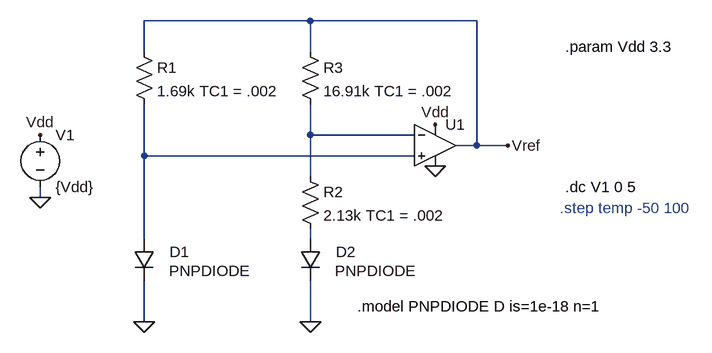
[diagram p0: schematic Bandgap_V1-sensitivity.asc]
Bandgap_V1-sensitivity.asc, the LTspice schematic file:
Version 4
SHEET 1 1104 680
WIRE 336 -288 80 -288
WIRE 592 -288 336 -288
WIRE 80 -240 80 -288
WIRE 336 -240 336 -288
WIRE 336 -112 336 -160
WIRE 496 -112 336 -112
WIRE 592 -96 592 -288
WIRE 592 -96 560 -96
WIRE 640 -96 592 -96
WIRE 80 -80 80 -160
WIRE 496 -80 80 -80
WIRE 336 -48 336 -112
WIRE -80 -16 -80 -32
WIRE 80 48 80 -80
WIRE 336 48 336 32
WIRE 80 176 80 112
WIRE 336 176 336 112
FLAG 336 176 0
FLAG 80 176 0
FLAG 528 -64 0
FLAG -80 -16 0
FLAG -80 -112 Vdd
FLAG 528 -128 Vdd
FLAG 640 -96 Vref
SYMBOL diode 64 48 R0
WINDOW 0 55 20 Left 2
WINDOW 3 54 49 Left 2
SYMATTR InstName D1
SYMATTR Value PNPDIODE
SYMBOL diode 320 48 R0
WINDOW 0 55 20 Left 2
WINDOW 3 54 49 Left 2
SYMATTR InstName D2
SYMATTR Value PNPDIODE
SYMBOL res 64 -256 R0
SYMATTR InstName R1
SYMATTR Value 1.69k TC1 = .002
SYMBOL res 320 -64 R0
SYMATTR InstName R2
SYMATTR Value 2.13k TC1 = .002
SYMBOL res 320 -256 R0
SYMATTR InstName R3
SYMATTR Value 16.91k TC1 = .002
SYMBOL voltage -80 -128 R0
WINDOW 123 0 0 Left 2
WINDOW 39 0 0 Left 2
SYMATTR InstName V1
SYMATTR Value {Vdd}
SYMBOL Opamps\\UniversalOpamp2 528 -96 R0
SYMATTR InstName U1
TEXT 408 152 Left 2 !.model PNPDIODE D is=1e-18 n=1
TEXT 720 0 Left 2 ;.step temp -50 100
TEXT 728 -248 Left 2 !.param Vdd 3.3
TEXT 728 -32 Left 2 !.dc V1 0 5

The netlist it stands for:
* Bandgap_V1-sensitivity.asc
D1 N002 0 PNPDIODE
D2 N003 0 PNPDIODE
R1 Vref N002 1.69k TC1 = .002
R2 N001 N003 2.13k TC1 = .002
R3 Vref N001 16.91k TC1 = .002
V1 Vdd 0 {Vdd}
XU1 N002 N001 Vdd 0 Vref level.2 Avol=1Meg GBW=10Meg Slew=10Meg ilimit=25m rail=0 Vos=0 phimargin=45 en=0 enk=0 in=0 ink=0 Rin=500Meg  ; pins IN+ IN- V+ V- OUT
.model D D
.lib standard.dio
.model PNPDIODE D is=1e-18 n=1
* .step temp -50 100
.param Vdd 3.3
.dc V1 0 5
.lib UniversalOpamps2.sub
.backanno
.end